# Altium schematic sheet Sheet1.SchDoc
size A; SheetNumber: 1; SheetTotal: 1
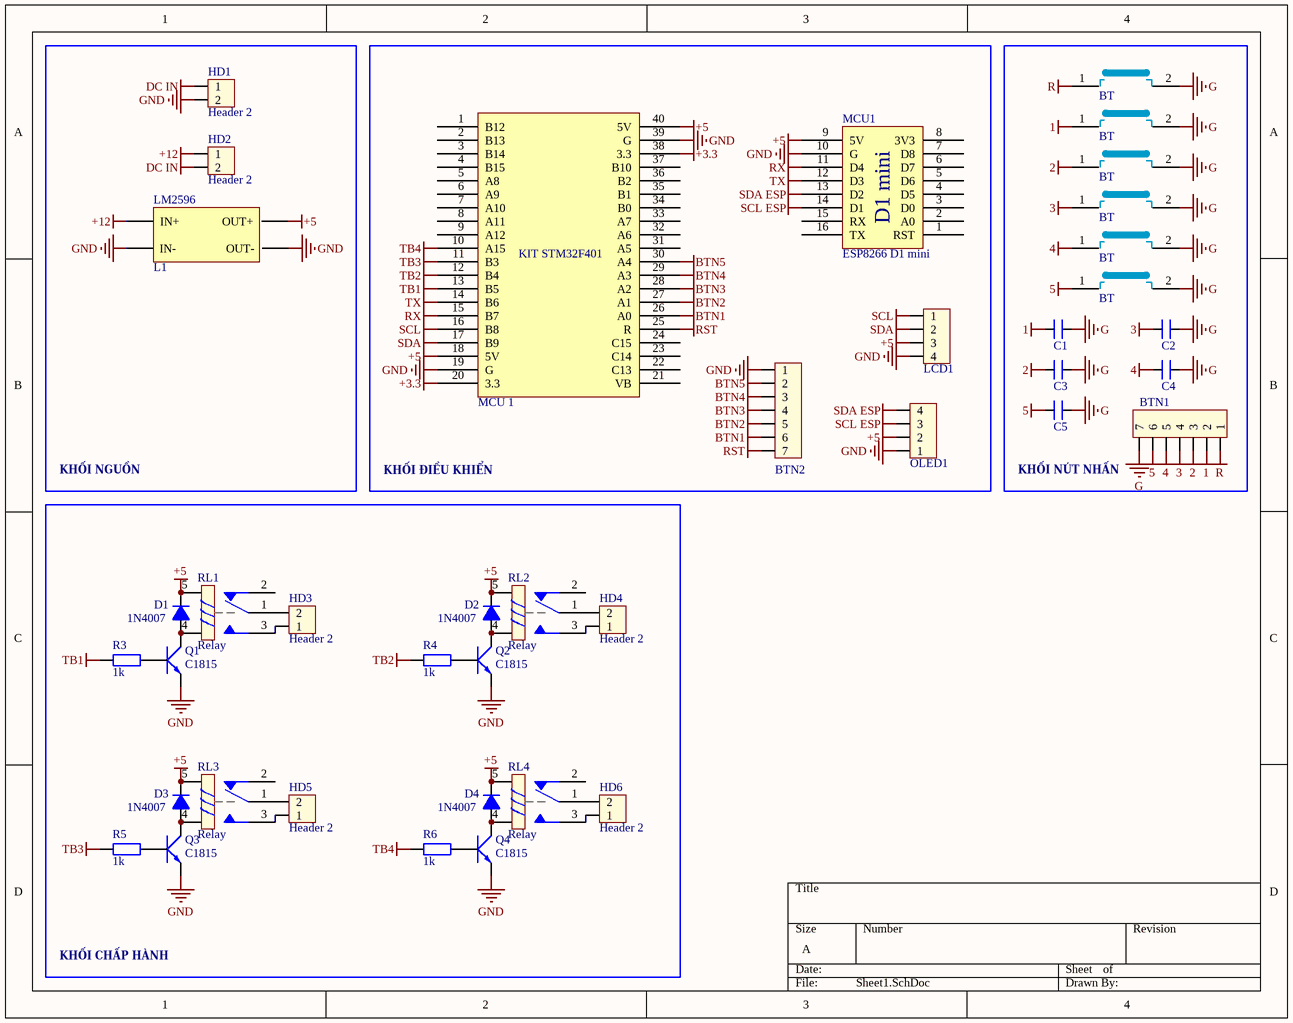
[diagram p0: Sheet1.SchDoc]

## Parts
BT1  BT  [SW4]
BT2  BT  [SW4]
BT3  BT  [SW4]
BT4  BT  [SW4]
BT5  BT  [SW4]
BT6  BT  [SW4]
BTN1  JP7  [CON7]  (value not drawn)
BTN2  JP7  [CON7]  (value not drawn)
C1  CAP gom  [CN1]  (value not drawn)
C2  CAP gom  [CN1]  (value not drawn)
C3  CAP gom  [CN1]  (value not drawn)
C4  CAP gom  [CN1]  (value not drawn)
C5  CAP gom  [CN1]  (value not drawn)
D1  1N4007  [D2A]
D2  1N4007  [D2A]
D3  1N4007  [D2A]
D4  1N4007  [D2A]
HD1  Header 2  [HED2]
HD2  Header 2  [HED2]
HD3  Header 2  [HED2]
HD4  Header 2  [HED2]
HD5  Header 2  [HED2]
HD6  Header 2  [HED2]
L1  BUCK_LM2596  [BUCK_LM2596]  (value not drawn)
LCD1  JP4  [CON4]  (value not drawn)
MCU1  ESP8266 D1 mini  [ESP D1 mini]
MCU_1  KIT STM32F401  [KIT STM32F401]  (value not drawn)
OLED1  JP4  [CON4]  (value not drawn)
Q1  C1815  [QTO-92]
Q2  C1815  [QTO-92]
Q3  C1815  [QTO-92]
Q4  C1815  [QTO-92]
R3  1k  [R1/2W]
R4  1k  [R1/2W]
R5  1k  [R1/2W]
R6  1k  [R1/2W]
RL1  Relay  [RL_SPDT_10A]
RL2  Relay  [RL_SPDT_10A]
RL3  Relay  [RL_SPDT_10A]
RL4  Relay  [RL_SPDT_10A]

## Blocks framed on the sheet
KHỐI NGUỒN: HD1 HD2 L1
KHỐI ĐIỀU KHIỂN: BTN2 LCD1 MCU1 MCU_1 OLED1
KHỐI NÚT NHẤN: BT1-BT6 BTN1 C1-C5
KHỐI CHẤP HÀNH: D1-D4 HD3-HD6 Q1-Q4 R3-R6 RL1-RL4

## Nets
1: BT2.1 BTN1.2 C1.2
2: BT3.1 BTN1.3 C3.2
3: BT4.1 BTN1.4 C2.2
4: BT5.1 BTN1.5 C4.2
5: BT6.1 BTN1.6 C5.2
+3.3: MCU_1.20(3.3) MCU_1.38(3.3)
+5: D1.2(K) D2.2(K) D3.2(K) D4.2(K) L1.4(OUT+) LCD1.3 MCU1.9(5V) MCU_1.18(5V) MCU_1.40(5V) OLED1.2 RL1.5 RL2.5 RL3.5 RL4.5
+12: HD2.1 L1.1(IN+)
BTN1: BTN2.6 MCU_1.26(A0)
BTN2: BTN2.5 MCU_1.27(A1)
BTN3: BTN2.4 MCU_1.28(A2)
BTN4: BTN2.3 MCU_1.29(A3)
BTN5: BTN2.2 MCU_1.30(A4)
DC IN: HD1.1 HD2.2
G: BT1.2 BT2.2 BT3.2 BT4.2 BT5.2 BT6.2 BTN1.7 C1.1 C2.1 C3.1 C4.1 C5.1
GND: BTN2.1 HD1.2 L1.2(IN-) L1.3(OUT-) LCD1.4 MCU1.10(G) MCU_1.19(G) MCU_1.39(G) OLED1.1 Q1.1(E) Q2.1(E) Q3.1(E) Q4.1(E)
R: BT1.1 BTN1.1
RST: BTN2.7 MCU_1.25(R)
RX: MCU1.11(D4) MCU_1.15(B7)
SCL: LCD1.1 MCU_1.16(B8)
SCL ESP: MCU1.14(D1) OLED1.3
SDA: LCD1.2 MCU_1.17(B9)
SDA ESP: MCU1.13(D2) OLED1.4
TB1: MCU_1.13(B5) R3.2
TB2: MCU_1.12(B4) R4.2
TB3: MCU_1.11(B3) R5.2
TB4: MCU_1.10(A15) R6.2
TX: MCU1.12(D3) MCU_1.14(B6)
NetD1_1: D1.1(A) Q1.2(C) RL1.4
NetD2_1: D2.1(A) Q2.2(C) RL2.4
NetD3_1: D3.1(A) Q3.2(C) RL3.4
NetD4_1: D4.1(A) Q4.2(C) RL4.4
NetHD3_1: HD3.1 RL1.3
NetHD3_2: HD3.2 RL1.1
NetHD4_1: HD4.1 RL2.3
NetHD4_2: HD4.2 RL2.1
NetHD5_1: HD5.1 RL3.3
NetHD5_2: HD5.2 RL3.1
NetHD6_1: HD6.1 RL4.3
NetHD6_2: HD6.2 RL4.1
NetQ1_3: Q1.3(B) R3.1
NetQ2_3: Q2.3(B) R4.1
NetQ3_3: Q3.3(B) R5.1
NetQ4_3: Q4.3(B) R6.1

Not connected (* = marked no-connect by the designer): MCU1 1(RST) 2(A0) 3(D0) 4(D5) 5(D6) 6(D7) 7(D8) 8(3V3) 15(RX) 16(TX); MCU_1 1(B12) 2(B13) 3(B14) 4(B15) 5(A8) 6(A9) 7(A10) 8(A11) 9(A12) 21(VB) 22(C13) 23(C14) 24(C15) 31(A5) 32(A6) 33(A7) 34(B0) 35(B1) 36(B2) 37(B10); RL1 2; RL2 2; RL3 2; RL4 2

## Notes on the sheet
- (in symbol BUCK_LM2596) LM2596
- (in symbol ESP8266 D1 mini) D1 mini

## Library data of the parts
BT1-BT6 = BUTTON
BTN1 BTN2 = Con7: Connector 7; Value: Connector 7
D1-D4 = D1A: Diode 1A; Value: 1N4007
HD1-HD6 = Hed2: Header 2 (Green); Value: Header 2
LCD1 OLED1 = Con4: Connector 4; Value: Connector 4
Q1-Q4 = C1815: NPN 600mW, ECB; Value: C1815
R3-R6 = R1/4W: Resistor 1/4W; Value: R1/4W - 1K
RL1-RL4 = Relay SRD: Relay SPDT 5 Pin; Value: Relay SPDT, 10A, 12V